# EAGLE design CV_Pot (EAGLE 7.6.0)
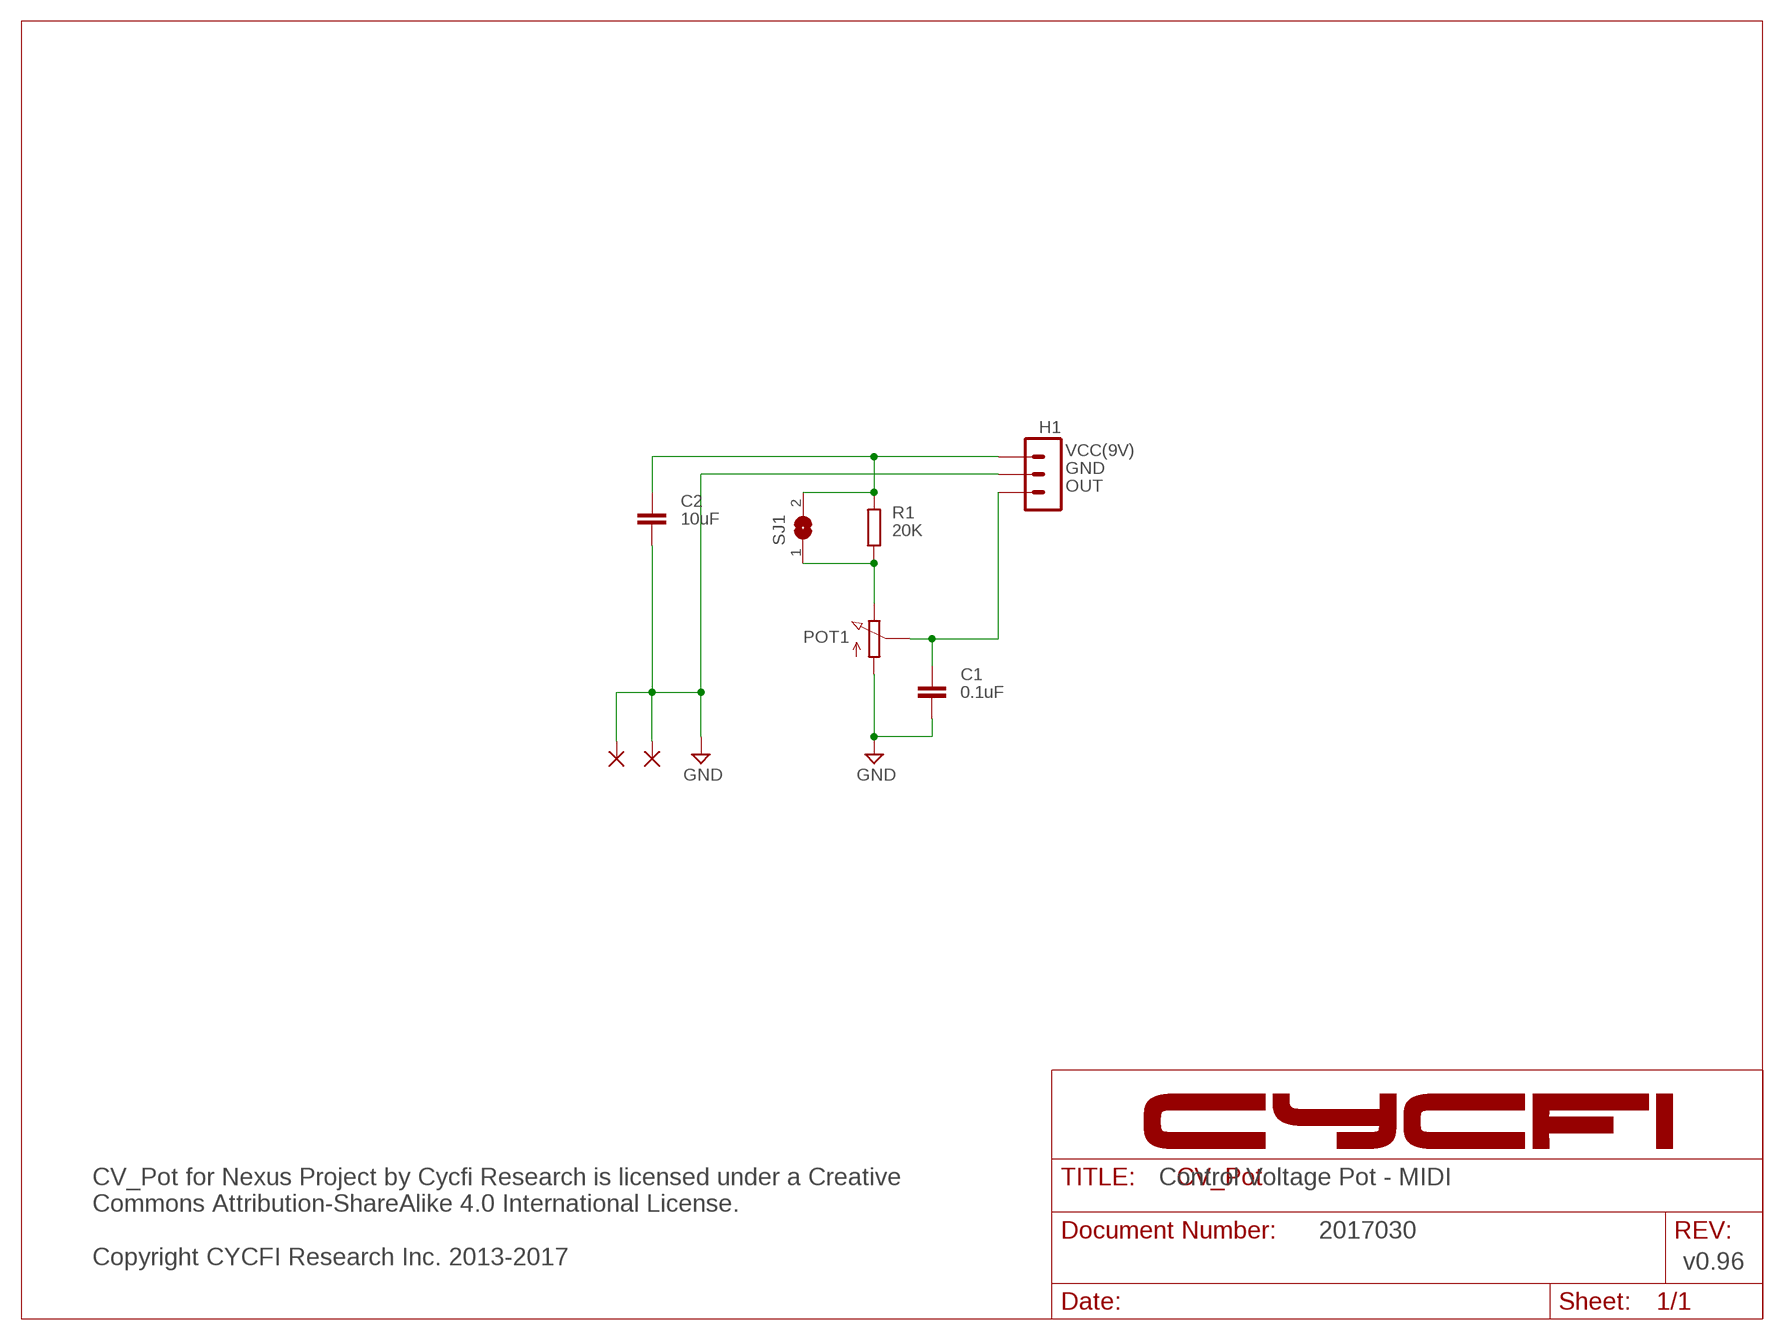
[diagram p0: schematic, sheet 1]

## Parts
C1  0.1uF  C-EUC0603  [C0603]
C2  10uF  C-EUC0805  [C0805]
GND1  SMD2  [SMD1,27-2,54]
GND2  SMD2  [SMD1,27-2,54]
H1  3PIN-SMD-2.54MM  [3P-SMD-2.54MM]
POT1  25K  POTPDB181GTR  [POT_EU_PDB181GTR]
R1  20K  R-EU_R0402  [R0402]
SJ1  SJ  [SJ]

## Nets
GND: C1.2 C2.2 GND1.1(P) GND2.1(P) H1.P$2 POT1.A1
N$1: C2.1 H1.P$3 R1.2 SJ1.2
N$2: POT1.A3 R1.1 SJ1.1
OUT: C1.1 H1.P$1 POT1.A2

## Notes on the sheet
- VCC(9V)
- GND
- OUT
- Control Voltage Pot - MIDI
- 2017030
- CV_Pot for Nexus Project by Cycfi Research is licensed under a Creative
  Commons Attribution-ShareAlike 4.0 International License. 
  
  Copyright CYCFI Research Inc. 2013-2017
- v0.96

## Library data of the parts
C1 C2 = resistor:C-EU: CAPACITOR, European symbol
GND1 GND2 = wirepad:SMD2: SMD PAD
H1 = CYCFI_Con:3PIN-SMD-2.54MM
POT1 = CYCFI_Passive:POT
R1 = resistor:R-EU_: RESISTOR, European symbol
SJ1 = jumper:SJ: SMD solder JUMPER

## Board
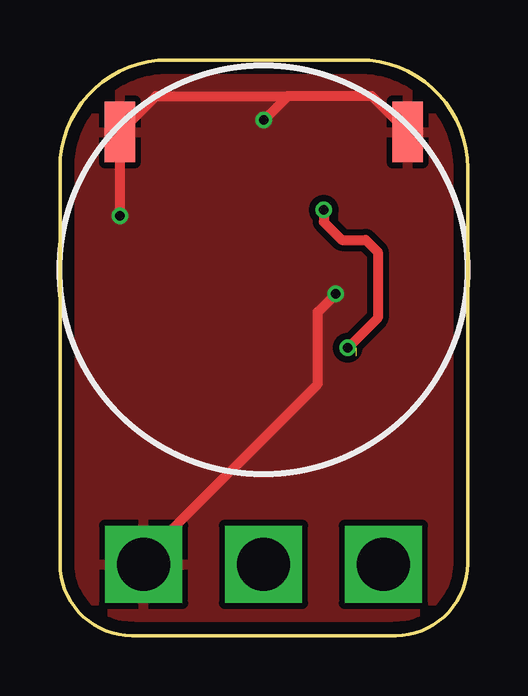
[diagram p1: board, top side]
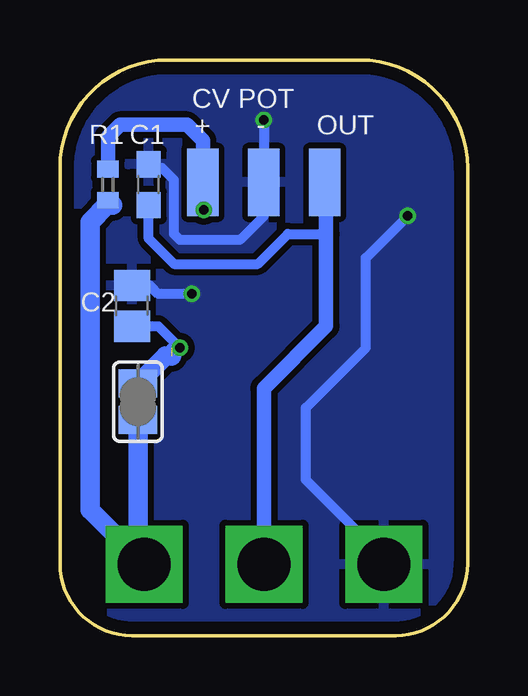
[diagram p2: board, bottom side, seen from below]

Size 17 x 24 mm. Coordinates in mm from the lower left corner, seen from the top.
Outline: 17,3 17,19.5 arc90 12.5,24 4.5,24 arc90 0,19.5 0,3 arc90 3,0 14,0 arc90 17,3
Copper layers (1*16): Top 0.035mm / dielectric 1.6mm / Bottom 0.035mm
Design rules "Elecrow_2-layer_PCB_eagle_rule": minimum track width 6mil, minimum drill 12mil, track to track 6mil, track to pad 8mil, pad to pad 12mil, via to via 12mil, smd to smd 0mil, copper to edge 20mil, drill to drill 10mil, minimum pad ring 6mil, minimum via ring 6mil, stop-mask expansion 0mil, vias tented up to drill 100mil, thermal gap 10mil

### Footprints (pad centres in the part's own frame; a part is rotated, then mirrored left to right if it is on the bottom)
C0603 = smd 1.1 x 1: 1 -0.85,0; 2 0.85,0
C0805 = smd 1.3 x 1.5: 1 -0.85,0; 2 0.85,0
SMD1,27-2,54 = smd 1.27 x 2.54: 1 0,0
3P-SMD-2.54MM = smd 1.3 x 2.8: P$1 -2.54,0; P$2 0,0; P$3 2.54,0
POT_EU_PDB181GTR = drill 2.2 square: A1 -5,0; A2 0,0; A3 5,0
R0402 = smd 0.7 x 0.9: 1 -0.65,0; 2 0.65,0
SJ = smd 1.168 x 1.6: 1 -0.762,0; 2 0.762,0

### Placement (x,y rotation side)
C1  13.3,18.8 90 bottom
C2  14,13.75 90 bottom
GND1  2.5,21 0 top
GND2  14.5,21 0 top
H1  8.5,18.9 180 bottom
POT1  8.49,2.97 0 top
R1  15,18.8 90 bottom
SJ1  13.75,9.75 90 bottom

### Tracks (layer width: path | path; a pad name or v marks a point on that pad's centre or on a via)
GND  (via drill 0.4)
  Top 0.406: 9.5,22.5 4,22.5 GND1.1 v2.5,17.5 | GND2.1 13,22.5 9.5,22.5 | 9.5,22.5 v8.5,21.5 | POT1.A1 3.49,3.24 10.75,10.5 10.75,13.5 v11.5,14.25
  Bottom 0.406: v8.5,21.5 H1.P$2 8.5,17.5 9.5,16.5 12,16.5 12.25,16.75 12.25,19 12.75,19.5 13.15,19.5 C1.2 | POT1.A1 3.49,3.24 6.75,6.5 6.75,9.5 4.25,12 4.25,15.75 v2.5,17.5 | v11.5,14.25 12.9,14.25 13.25,14.6 C2.2
  pour Top (isolate 0.254): 17,3 17,19.5 arc90 12.5,24 4.5,24 arc90 0,19.5 0,3 arc90 3,0 14,0 arc90
  pour Bottom (isolate 0.254): 0,3 0,19.5 arc-90 4.5,24 12.5,24 arc-90 17,19.5 17,3 arc-90 14,0 3,0 arc-90
N$1  (via drill 0.4)  (1 unrouted)
  Top 0.406: v11,17.75 11,17.25 11.75,16.5 12.75,16.5 13.25,16 13.25,13.25 v12,12
  Bottom 0.406: H1.P$3 11.04,17.79 v11,17.75 | 12.35,12 v12,12 12.9,12.9 C2.1
  Bottom 0.61: H1.P$3 11.04,20.64 11.7,21.3 14.5,21.3 15,20.8 R1.2
  Bottom 0.813: 12.35,11.66 12.6,11.66 SJ1.2
N$2
  Bottom 0.61: POT1.A3 13.49,2.99 | 14.8,17.95 R1.1
  Bottom 0.813: 14.8,17.95 15.05,17.95 15.75,17.25 15.75,5.23 POT1.A3 13.75,3.23 SJ1.1
OUT
  Bottom 0.406: 5.9,16.75 7.5,16.75 8.75,15.5 12.25,15.5 13.3,16.55 C1.1
  Bottom 0.61: H1.P$1 5.9,18.84 5.9,16.75 5.9,12.9 8.49,10.31 POT1.A2

### Text on the board
bNames: CV POT | OUT | - | + | C1 | R1